# Altium schematic sheet Sheet2.SchDoc: {Title}
size 420 x 297 mm; Date: 2018-01-17; ApprovedBy: {ApprovedBy}; CheckedBy: {TechnicalReference}; Author: {CreatedBy}; CompanyName: Diakont; DocumentNumber: ЭИТЦЯ.468332.338 Э3; Revision: A; SheetNumber: 2; Title0: {Title0}; DocumentType: {DocumentType}; TechControl: {TechControl}; PageSetup: Record=PageOptions|CenterHorizontal=True|CenterVertical=True|PrintScale=0.96|XCorrection=1.00|YCorrection=1.00|PrintKind=1|BorderSize=5000000|LeftOffset=0|BottomOffset=0|Orientation=2|PaperLength=1000|PaperWidth=1000|Scale=100|PaperSource=7|PrintQuality=-4|MediaType=1|DitherType=10|PaperKind=A3|PrintScaleMode=1; Language: en; ResponsibleDept: DED; DocumentStatus: Released; DecimalNumber: ЭИТЦЯ.468332.338 Э3
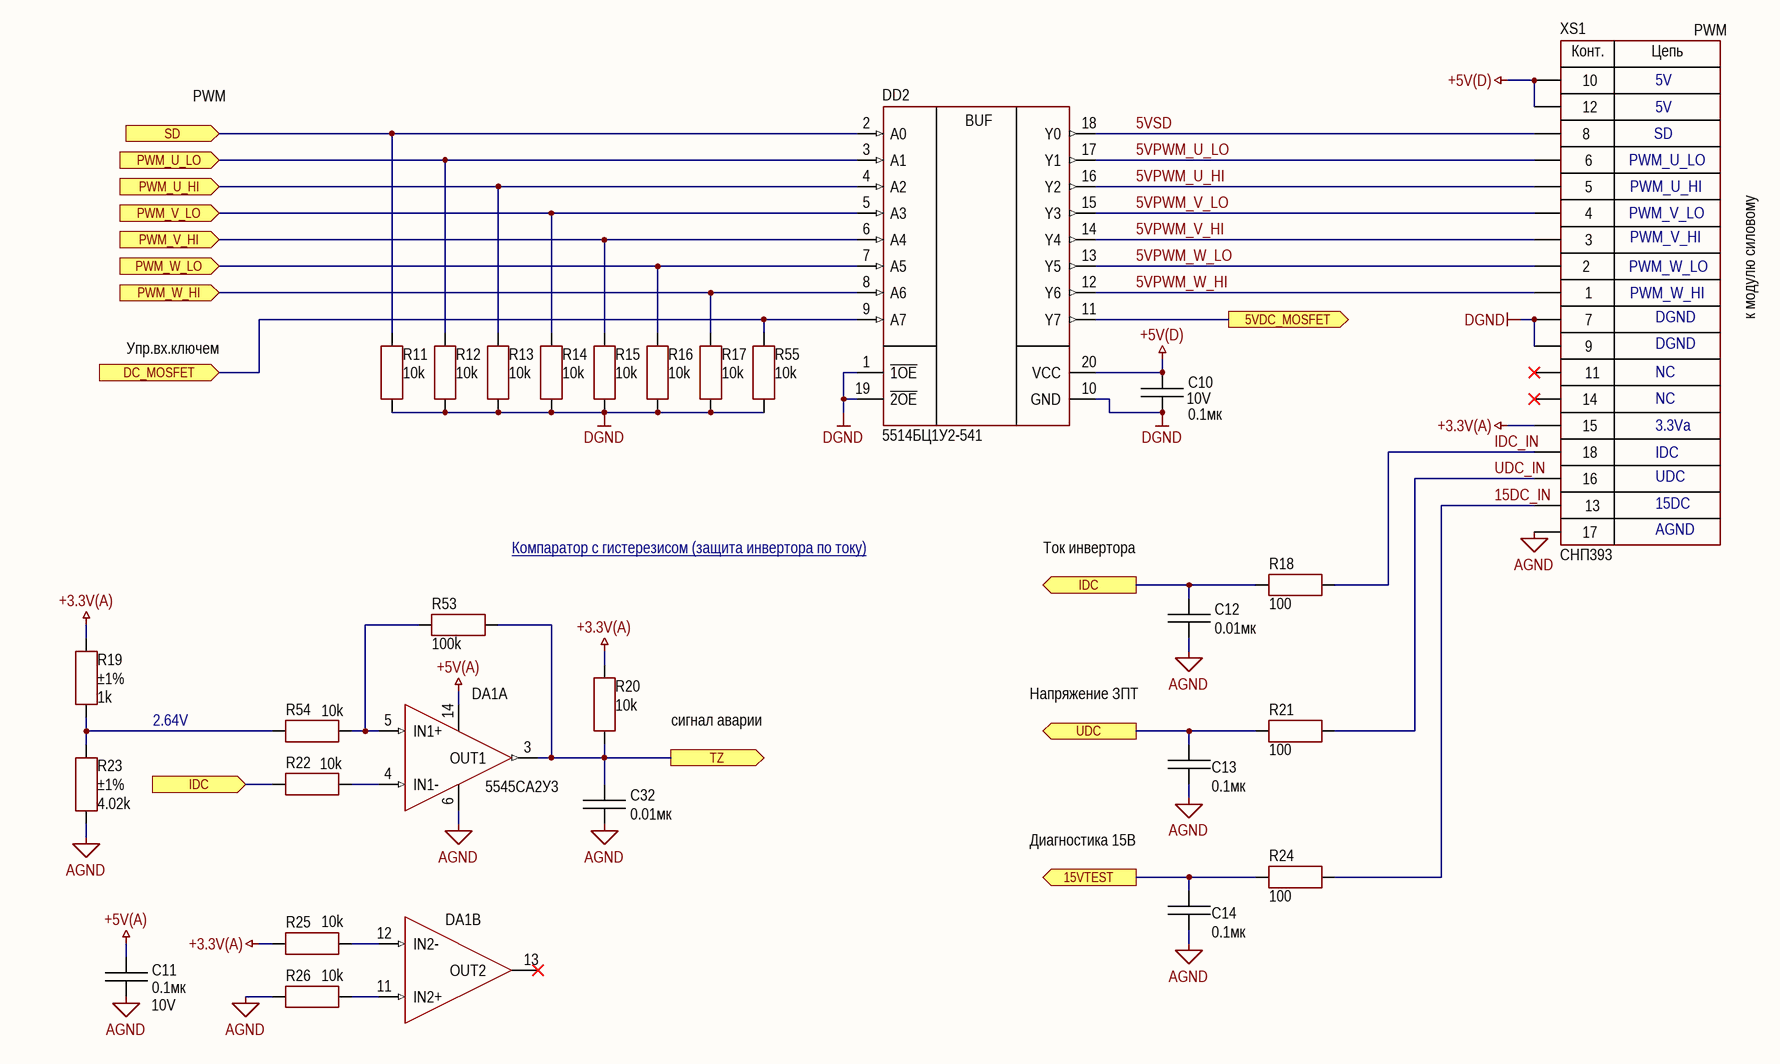
[diagram p0: Sheet2.SchDoc]

## Parts
C10  value 0.1мк  Voltage: 10V  [CAP: 0603P]
C11  value 0.1мк  Voltage: 10V  [CAP: 0603P]
C12  value 0.01мк  [CAP: 0603P]
C13  value 0.1мк  [CAP: 0603P]
C14  value 0.1мк  [CAP: 0603P]
C32  value 0.01мк  [CAP: 0603P]
DA1  (no value)  [16-Н04.16-1B]  (parts A,B of 2)
DD2  (no value)  [20-QLCC (5121.20-A)]
R11  value 10k  [RES: 0603P]
R12  value 10k  [RES: 0603P]
R13  value 10k  [RES: 0603P]
R14  value 10k  [RES: 0603P]
R15  value 10k  [RES: 0603P]
R16  value 10k  [RES: 0603P]
R17  value 10k  [RES: 0603P]
R18  value 100  [RES: 0603P]
R19  value 1k  Tolerance: ±1%  [RES: 0603P]
R20  value 10k  [RES: 0603P]
R21  value 100  [RES: 0603P]
R22  value 10k  [RES: 0603P]
R23  value 4.02k  Tolerance: ±1%  [RES: 0603P]
R24  value 100  [RES: 0603P]
R25  value 10k  [RES: 0603P]
R26  value 10k  [RES: 0603P]
R53  value 100k  [RES: 0603P]
R54  value 10k  [RES: 0603P]
R55  value 10k  [RES: 0603P]
XS1  CommentText: СНП393  [CON: PBD-18]

## Ports
5VDC_MOSFET (out), 15VTEST (out), DC_MOSFET (in), IDC (in), IDC (out), PWM_U_HI (in), PWM_U_LO (in), PWM_V_HI (in), PWM_V_LO (in), PWM_W_HI (in), PWM_W_LO (in), SD (in), TZ (out), UDC (out)

## Nets
+3.3V(A): R19.1 R20.1 R25.2 XS1.15
+5V(A): C11.2 DA1.14(V+)
+5V(D): C10.2 DD2.20(VCC) XS1.10 XS1.12
AGND: C11.1 C12.2 C13.1 C14.1 C32.2 DA1.6(V-) R23.2 R26.2 XS1.17
DGND: C10.1 DD2.1(~{1OE}) DD2.10(GND) DD2.19(~{2OE}) R11.2 R12.2 R13.2 R14.2 R15.2 R16.2 R17.2 R55.2 XS1.7 XS1.9
5VDC_MOSFET: DD2.11(Y7) ; port 5VDC_MOSFET
5VPWM_U_HI: DD2.16(Y2) XS1.5
5VPWM_U_LO: DD2.17(Y1) XS1.6
5VPWM_V_HI: DD2.14(Y4) XS1.3
5VPWM_V_LO: DD2.15(Y3) XS1.4
5VPWM_W_HI: DD2.12(Y6) XS1.1
5VPWM_W_LO: DD2.13(Y5) XS1.2
5VSD: DD2.18(Y0) XS1.8
15DC_IN: R24.1 XS1.13
15VTEST: C14.2 R24.2 ; port 15VTEST
DC_MOSFET: DD2.9(A7) R55.1 ; port DC_MOSFET
IDC: C12.1 R18.2 R22.1 ; port IDC
IDC_IN: R18.1 XS1.18
PWM_U_HI: DD2.4(A2) R13.1 ; port PWM_U_HI
PWM_U_LO: DD2.3(A1) R12.1 ; port PWM_U_LO
PWM_V_HI: DD2.6(A4) R15.1 ; port PWM_V_HI
PWM_V_LO: DD2.5(A3) R14.1 ; port PWM_V_LO
PWM_W_HI: DD2.8(A6) R17.1 ; port PWM_W_HI
PWM_W_LO: DD2.7(A5) R16.1 ; port PWM_W_LO
SD: DD2.2(A0) R11.1 ; port SD
TZ: C32.1 DA1.3(OUT1) R20.2 R53.2 ; port TZ
UDC: C13.2 R21.2 ; port UDC
UDC_IN: R21.1 XS1.16
NetDA1_4: DA1.4(IN1-) R22.2
NetDA1_5: DA1.5(IN1+) R53.1 R54.2
NetDA1_11: DA1.11(IN2+) R26.1
NetDA1_12: DA1.12(IN2-) R25.1
NetR19_2: R19.2 R23.1 R54.1

Not connected (* = marked no-connect by the designer): DA1 13(OUT2)*; XS1 11* 14*

## Notes on the sheet
- 5V
- PWM
- SD
- PWM_U_LO
- PWM_V_LO
- PWM_U_HI
- PWM_W_LO
- PWM_V_HI
- Упр.вх.ключем
- PWM_W_HI
- DGND
- к модулю силовому
- NC
- 3.3Va
- IDC
- UDC
- Компаратор c гистерезисом (защита инвертора по току)
- Ток инвертора
- 15DC
- AGND
- 2.64V
- сигнал аварии
- Напряжение ЗПТ
- Диагностика 15В
- Подп. и дата
- Инв. № дубл.
- Взам. инв. №
- Инв. № подл.
- Лист
- Изм.
- № докум.
- Подп.
- Дата
- Копировал
- Формат A3
- (in symbol 5514БЦ1У2-541) BUF
- (in symbol PBD-18) Конт.; Цепь

## Library data of the parts
C10 C11 = Ceramic_0603: Manufacturer: Гириконд; PartNumber: К10-79-10В-0,1 мкФ +80-20% H90; ValueManufacturerPartNumber: Ceramic capacitor, 0.1мк, H90, +80-20%, 10V, 0603, -55...+125°C; TypeCapacitor: Ceramic capacitor; Tolerance: +80-20%; TypeDielectric: H90; MAX: 00131675; Package: 0603; HelpURL: http://www.giricond.ru/files/k10-79_vp_2018_saiyt.pdf; Temperature: -55...+125°C
C12 C32 = Ceramic_0603: Manufacturer: Монолит; PartNumber: К10-84в-1608М-50В-0.01мк ±20%-Н20-N-A; ValueManufacturerPartNumber: Ceramic capacitor, 0.01мк, H20, ±20%, 50V, 0603, -55...+125°C; TypeCapacitor: Ceramic capacitor; Tolerance: ±20%; TypeDielectric: H20; Voltage: 50V; Analog: MAX 00131676 (pin-to-pin); Package: 0603; HelpURL: http://www.monolit.vitebsk.by/Files/K10-84.pdf; Temperature: -55...+125°C
C13 C14 = Ceramic_0603: Manufacturer: Гириконд; PartNumber: К10-79-10В-0,1 мкФ +80-20% H90; ValueManufacturerPartNumber: Ceramic capacitor, 0.1мк, H90, +80-20%, 10V, 0603, -55...+125°C; TypeCapacitor: Ceramic capacitor; Tolerance: +80-20%; TypeDielectric: H90; Voltage: 10V; MAX: 00131675; Package: 0603; HelpURL: http://www.giricond.ru/files/k10-79_vp_2018_saiyt.pdf; Temperature: -55...+125°C
DA1 = 5545СА2У3: Comparator USSR; Manufacturer: НПП ВОСТОК; ValueManufacturerPartNumber: IC comparator, Open Drain, от ± 1,5В до ± 16,5В, -60...+125°C, Н04.16-1В; Supply: от ± 1,5В до ± 16,5В; OutputType: Open Drain; Analog: LM2903D; TY: АЕЯР.431350.632-02 ТУ; HelpURL: http://www.vostok.nsk.su/files/pdf/152181836987_5545ca2u3.pdf; Package: Н04.16-1В; ComponentType: IC comparator; Temperature: -60...+125°C; PartNumber: 5545СА2У3
DD2 = 5514БЦ1У2-541: USSR Buffer QFN; Manufacturer: Анстрем; ValueManufacturerPartNumber: 8 канальный буфер, 4.5..5.5V, -60...+125°C, 5121.20-A; Supply: 4.5..5.5V; Analog: функц.-й аналог 74(54)HC 541; Package: 5121.20-A; ComponentType: 8 канальный буфер; Temperature: -60...+125°C; PartNumber: 5514БЦ1У2-541
R11-R17 R20 R22 R25 R26 R54 R55 = Resistor_0603: Manufacturer: ОАО Ресурс; PartNumber: Р1-12-0,1ум.-10~кОм ±5%-М ШКАБ.434110.002 ТУ; ValueManufacturerPartNumber: Resistor film, 10k, ±5%, 0603, 0.1W, -55...+125°C; TypeResistor: Resistor film; Power: 0.1W; Tolerance: ±5%; MAX: 00133985; Analog: MAX 00133986 (1%); Package: 0603; HelpURL: https://aoresurs.com/catalog/chip_rezistory/rezistory-r1-12-kategoriya-kachestva-vp-/; Temperature: -55...+125°C
R18 R21 R24 = Resistor_0603: Manufacturer: ОАО Ресурс; PartNumber: Р1-12-0,1ум.-100~Ом ±5%-М ШКАБ.434110.002 ТУ; ValueManufacturerPartNumber: Resistor film, 100, ±5%, 0603, 0.1W, -55...+125°C; TypeResistor: Resistor film; Power: 0.1W; Tolerance: ±5%; MAX: 00133991; Package: 0603; HelpURL: https://aoresurs.com/catalog/chip_rezistory/rezistory-r1-12-kategoriya-kachestva-vp-/; Temperature: -55...+125°C
R19 = Resistor_0603: Manufacturer: ОАО Ресурс; PartNumber: Р1-12-0,1ум.-1~кОм ±1%-М ШКАБ.434110.002 ТУ; ValueManufacturerPartNumber: Resistor film, 1k, ±1%, 0603, 0.1W, -55...+125°C; TypeResistor: Resistor film; Power: 0.1W; MAX: 00133971; Package: 0603; HelpURL: https://aoresurs.com/catalog/chip_rezistory/rezistory-r1-12-kategoriya-kachestva-vp-/; Temperature: -55...+125°C
R23 = Resistor_0603: Manufacturer: ОАО Ресурс; PartNumber: Р1-12-0,1ум.-4.02~кОм ±1%-М ШКАБ.434110.002 ТУ; ValueManufacturerPartNumber: Resistor film, 4.02k, ±1%, 0603, 0.1W, -55...+125°C; TypeResistor: Resistor film; Power: 0.1W; MAX: 00134054; Package: 0603; HelpURL: https://aoresurs.com/catalog/chip_rezistory/rezistory-r1-12-kategoriya-kachestva-vp-/; Temperature: -55...+125°C
R53 = Resistor_0603: Manufacturer: ОАО Ресурс; PartNumber: Р1-12-0,1ум.-100~кОм ±5%-М ШКАБ.434110.002 ТУ; ValueManufacturerPartNumber: Resistor film, 100k, ±5%, 0603, 0.1W, -55...+125°C; TypeResistor: Resistor film; Power: 0.1W; Tolerance: ±5%; MAX: 00133990; Analog: MAX 00122851; Package: 0603; HelpURL: https://aoresurs.com/catalog/chip_rezistory/rezistory-r1-12-kategoriya-kachestva-vp-/; Temperature: -55...+125°C
XS1 = PBD-18: Manufacturer: Электродеталь; ValueManufacturerPartNumber: Connector, 18pin, 2.54mm, 500VAC, 3A; PartNumber: СНП393-18РП21-2 РЮМК.430420.035 ТУ; TypeConnector: Connector; VoltageMax: 500VAC; Pitch: 2.54mm; CurrentMax: 3A; Multichannel: 18pin; Analog: MAX 00135030 с доработкой до 18-pin; HelpURL: https://www.elektrodetal.com/catalog/snp393/